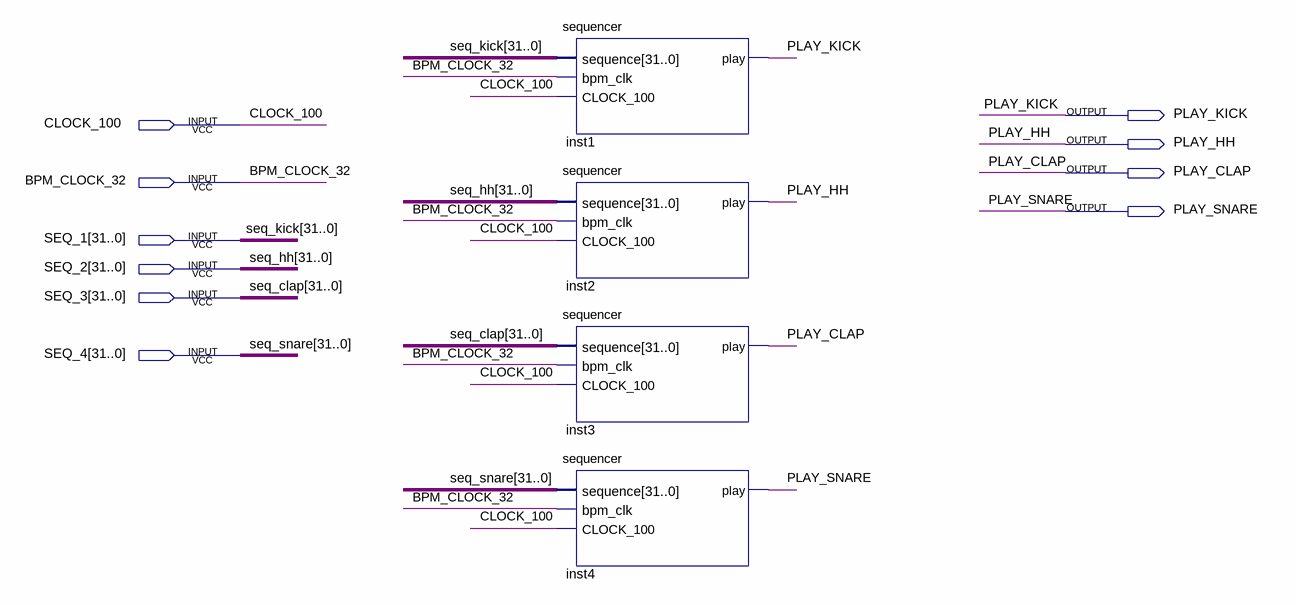
[diagram p0: schematic sheet]
// Quartus schematic sequencer_4.bdf as structural Verilog: 4 symbols, 10 pins
module sequencer_4 (
  input  CLOCK_100,
  input  BPM_CLOCK_32,
  input  [31:0] SEQ_1,
  input  [31:0] SEQ_2,
  input  [31:0] SEQ_3,
  input  [31:0] SEQ_4,
  output PLAY_KICK,
  output PLAY_HH,
  output PLAY_CLAP,
  output PLAY_SNARE
);

  sequencer inst1 (.\sequence (SEQ_1), .bpm_clk(BPM_CLOCK_32), .CLOCK_100(CLOCK_100), .play(PLAY_KICK));
  sequencer inst2 (.\sequence (SEQ_2), .bpm_clk(BPM_CLOCK_32), .CLOCK_100(CLOCK_100), .play(PLAY_HH));
  sequencer inst3 (.\sequence (SEQ_3), .bpm_clk(BPM_CLOCK_32), .CLOCK_100(CLOCK_100), .play(PLAY_CLAP));
  sequencer inst4 (.\sequence (SEQ_4), .bpm_clk(BPM_CLOCK_32), .CLOCK_100(CLOCK_100), .play(PLAY_SNARE));

  // Other names for the same wires on the sheet: seq_clap[31:0] = SEQ_3; seq_hh[31:0] = SEQ_2; seq_kick[31:0] = SEQ_1;
  //   seq_snare[31:0] = SEQ_4
endmodule
